# EAGLE schematic mdac-attenuator (EAGLE 7.7.0)
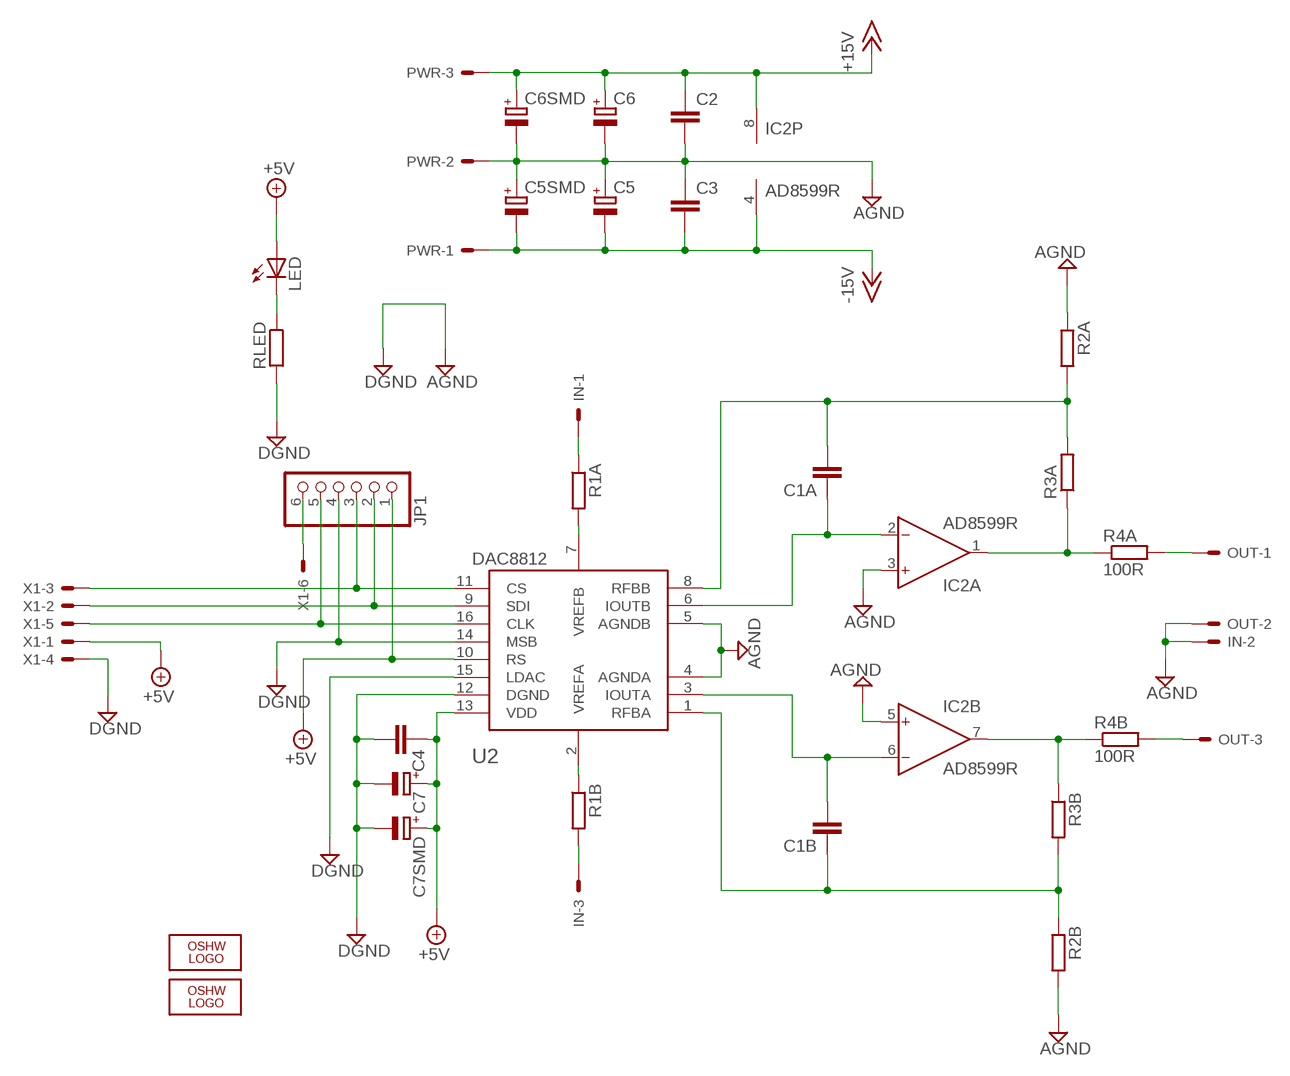
[diagram p0: schematic, sheet 1]

## Parts
C1A  C-EUC0805  [C0805]
C1B  C-EUC0805  [C0805]
C2  C-EUC1206  [C1206]
C3  C-EUC1206  [C1206]
C4  C-EUC1206  [C1206]
C5  CPOL-EUE3.5-8  [E3,5-8]
C5SMD  CPOL-EUE  [PANASONIC_E]
C6  CPOL-EUE3.5-8  [E3,5-8]
C6SMD  CPOL-EUE  [PANASONIC_E]
C7  CPOL-EUE3.5-8  [E3,5-8]
C7SMD  CPOL-EUD  [PANASONIC_D]
IC2  AD8599R  [SO8]
IN  22-23-2031  [22-23-2031]
JP1  PINHD-1X6  [1X06]
LED  LEDSMT1206  [1206]
LOGO1  OSHW_LOGO_FILLX0200-NT  [OSHW_FILLX200_NOTEXT]
LOGO2  OSHW_LOGO_FILLX0200-NT  [OSHW_FILLX200_NOTEXT]
OUT  22-23-2031  [22-23-2031]
PWR  22-23-2031  [22-23-2031]
R1A  R-EU_R1206  [R1206]
R1B  R-EU_R1206  [R1206]
R2A  R-EU_R1206  [R1206]
R2B  R-EU_R1206  [R1206]
R3A  R-EU_R1206  [R1206]
R3B  R-EU_R1206  [R1206]
R4A  100R  R-EU_R1206  [R1206]
R4B  100R  R-EU_R1206  [R1206]
RLED  R-EU_R1206  [R1206]
U2  DAC8812  [TSSOP16]
X1  22-23-2061  [22-23-2061]

## Nets
+5V: C4.1 C7.+ C7SMD.+ JP1.1 LED.A U2.10(RS) U2.13(VDD) X1.1
+15V: C2.1 C6.+ C6SMD.+ IC2.8(P:V+) PWR.3
-15V: C3.2 C5.- C5SMD.- IC2.4(P:V-) PWR.1
AGND: C2.2 C3.1 C4.2 C5.+ C5SMD.+ C6.- C6SMD.- C7.- C7SMD.- IC2.3(A:IN+) IC2.5(B:IN+) IN.2 JP1.4 OUT.2 PWR.2 R2A.1 R2B.2 RLED.2 U2.4(AGNDA) U2.5(AGNDB) U2.12(DGND) U2.14(MSB) U2.15(LDAC) X1.4 ; supply symbol labelled DGND
CLK: JP1.5 U2.16(CLK) X1.5
CS: JP1.3 U2.11(CS) X1.3
INL: IN.1 R1A.1
INR: IN.3 R1B.2
N$1: C1A.1 IC2.2(A:IN-) U2.6(IOUTB)
N$2: C1B.2 IC2.6(B:IN-) U2.3(IOUTA)
N$3: R1B.1 U2.2(VREFA)
N$4: IC2.7(B:OUT) R3B.1 R4B.1
N$5: JP1.6 X1.6
N$7: LED.C RLED.1
N$8: IC2.1(A:OUT) R3A.1 R4A.1
N$9: R1A.2 U2.7(VREFB)
N$12: C1A.2 R2A.2 R3A.2 U2.8(RFBB)
N$19: C1B.1 R2B.1 R3B.2 U2.1(RFBA)
OUTL: OUT.1 R4A.2
OUTR: OUT.3 R4B.2
SDI: JP1.2 U2.9(SDI) X1.2

## Library data of the parts
C1A C1B C2-C4 = rcl:C-EU: CAPACITOR, European symbol
C5 C5SMD C6 C6SMD C7 C7SMD = rcl:CPOL-EU: POLARIZED CAPACITOR, European symbol
IC2 = analog-devices-3:AD8599: Single and Dual, Ultralow Distortion, Ultralow Noise Op Amps Source: http://www.analog.com/static/imported-files/data_sheets/AD8597_8599.pdf
IN OUT PWR = con-molex:22-23-2031: .100" (2.54mm) Center Header - 3 Pin; MF: MOLEX; MPN: 22-23-2031; OC_FARNELL: 1462950; OC_NEWARK: 30C0862
JP1 = pinhead:PINHD-1X6: PIN HEADER
LED = led:LED: LED OSRAM: - CHIPLED LG R971, LG N971, LY N971, LG Q971, LY Q971, LO R971, LY R971 LH N974, LH R974 LS Q976, LO Q976, LY Q976 LO Q996 - Hyper CHIPLED LW Q18S LB Q993, LB Q99A, LB R99A - SideLED LS A670, LO A670, LY A670, LG A670, LP A670 LB A673, LV A673, LT A673, LW A673 LH A674 LY A675 LS A676, LA A676, LO A676, LY A676, LW A676 LS A679, LY A679, LG A679 - Hyper Micro SIDELED® LS Y876, LA Y876, LO Y876, LY Y876 LT Y87S - SmartLED LW L88C, LW L88S LB L89C, LB L89S, LG L890 LS L89K, LO L89K, LY L89K LS L896, LA L896, LO L896, LY L896 - TOPLED LS T670, LO T670, LY T670, LG T670, LP T670 LSG T670, LSP T670, LSY T670, LOP T670, LYG T670 LG T671, LOG T671, LSG T671 LB T673, LV T673, LT T673, LW T673 LH T674 LS T676, LA T676, LO T676, LY T676, LB T676, LH T676, LSB T676, LW T676 LB T67C, LV T67C, LT T67C, LS T67K, LO T67K, LY T67K, LW E67C LS E67B, LA E67B, LO E67B, LY E67B, LB E67C, LV E67C, LT E67C LW T67C LS T679, LY T679, LG T679 LS T770, LO T770, LY T770, LG T770, LP T770 LB T773, LV T773, LT T773, LW T773 LH T774 LS E675, LA E675, LY E675, LS T675 LS T776, LA T776, LO T776, LY T776, LB T776 LHGB T686 LT T68C, LB T68C - Hyper Mini TOPLED® LB M676 - Mini TOPLED Santana® LG M470 LS M47K, LO M47K, LY M47K Source: http://www.osram.convergy.de LUXEON: - LUMILED® LXK2-PW12-R00, LXK2-PW12-S00, LXK2-PW14-U00, LXK2-PW14-V00 LXK2-PM12-R00, LXK2-PM12-S00, LXK2-PM14-U00 LXK2-PE12-Q00, LXK2-PE12-R00, LXK2-PE12-S00, LXK2-PE14-T00, LXK2-PE14-U00 LXK2-PB12-K00, LXK2-PB12-L00, LXK2-PB12-M00, LXK2-PB14-N00, LXK2-PB14-P00, LXK2-PB14-Q00 LXK2-PR12-L00, LXK2-PR12-M00, LXK2-PR14-Q00, LXK2-PR14-R00 LXK2-PD12-Q00, LXK2-PD12-R00, LXK2-PD12-S00 LXK2-PH12-R00, LXK2-PH12-S00 LXK2-PL12-P00, LXK2-PL12-Q00, LXK2-PL12-R00 Source: www.luxeon.com KINGBRIGHT: KA-3528ASYC Source: www.kingbright.com
LOGO1 LOGO2 = ohw-logo:OSHW_LOGO_FILL
R1A R1B R2A R2B R3A R3B R4A R4B RLED = rcl:R-EU_: RESISTOR, European symbol
U2 = DAC8812:DAC8812: DAC8812 - Dual, Serial Input 16-Bit Multiplying Digital-to-Analog Converter Technical Specifications: Relative Accuracy: 1 LSB Max Differential Nonlinearity: 1 LSB Max 2-mA Full-Scale Current ±20%, with VREF = ±10 V 0.5 µs Settling Time Midscale or Zero-Scale Reset Separate 4Q MultiplyingReference Inputs Reference Bandwidth: 10 MHz Reference Dynamics: -105 dB THD SPI™-Compatible 3-Wire Interface: 50 MHz Double Buffered Registers to Enable Simultaneous Multichannel Update Internal Power On Reset Industry-Standard Pin Configuration Datasheet URL: http://www.ti.com/lit/ds/symlink/dac8812.pdf
X1 = con-molex:22-23-2061: .100" (2.54mm) Center Header - 6 Pin; MF: MOLEX; MPN: 22-23-2061; OC_FARNELL: 1462922; OC_NEWARK: 27C1933